# EAGLE schematic DRONEV1 (EAGLE 9.5.1)
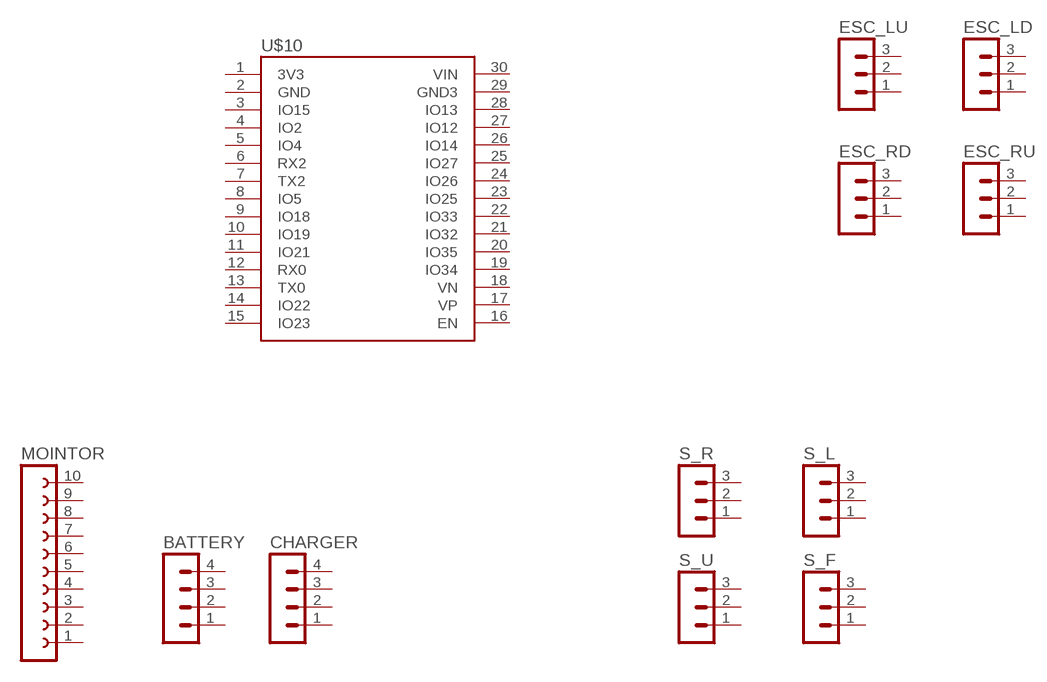
[diagram p0: schematic, sheet 1]

## Parts
BATTERY  MA04-1  [MA04-1]
CHARGER  MA04-1  [MA04-1]
ESC_LD  MA03-1  [MA03-1]
ESC_LU  MA03-1  [MA03-1]
ESC_RD  MA03-1  [MA03-1]
ESC_RU  MA03-1  [MA03-1]
MOINTOR  FE10-1  [FE10]
S_F  MA03-1  [MA03-1]
S_L  MA03-1  [MA03-1]
S_R  MA03-1  [MA03-1]
S_U  MA03-1  [MA03-1]
U$1  MODULE_ESP32_MYV  [MODULE_ESP32-DEVKITC-MYV]  (not placed on a sheet)
U$2  MODULE_ESP32_MYV  [MODULE_ESP32-DEVKITC-MYV]  (not placed on a sheet)
U$3  MODULE_ESP32_MYV  [MODULE_ESP32-DEVKITC-MYV]  (not placed on a sheet)
U$4  MODULE_ESP32_MYV  [MODULE_ESP32-DEVKITC-MYV]  (not placed on a sheet)
U$5  MODULE_ESP32_MYV  [MODULE_ESP32-DEVKITC-MYV]  (not placed on a sheet)
U$6  MODULE_ESP32_MYV  [MODULE_ESP32-DEVKITC-MYV]  (not placed on a sheet)
U$7  MODULE_ESP32_MYV  [MODULE_ESP32-DEVKITC-MYV]  (not placed on a sheet)
U$8  MODULE_ESP32_MYV  [MODULE_ESP32-DEVKITC-MYV]  (not placed on a sheet)
U$9  MODULE_ESP32_MYV  [MODULE_ESP32-DEVKITC-MYV]  (not placed on a sheet)
U$10  MODULE_ESP32_MYV  [MODULE_ESP32-DEVKITC-MYV]
Unconnected: BATTERY.1 BATTERY.2 BATTERY.3 BATTERY.4 CHARGER.1 CHARGER.2 CHARGER.3 CHARGER.4 ESC_LD.1 ESC_LD.2 ESC_LD.3 ESC_LU.1 ESC_LU.2 ESC_LU.3 ESC_RD.1 ESC_RD.2 ESC_RD.3 ESC_RU.1 ESC_RU.2 ESC_RU.3 MOINTOR.1 MOINTOR.2 MOINTOR.3 MOINTOR.4 MOINTOR.5 MOINTOR.6 MOINTOR.7 MOINTOR.8 MOINTOR.9 MOINTOR.10 S_F.1 S_F.2 S_F.3 S_L.1 S_L.2 S_L.3 S_R.1 S_R.2 S_R.3 S_U.1 S_U.2 S_U.3 U$1.2(GND) U$1.3(IO15) U$1.4(IO2) U$1.5(IO4) U$1.6(RX2) U$1.7(TX2) U$1.8(IO5) U$1.9(IO18) U$1.10(IO19) U$1.11(IO21) U$1.12(RX0) U$1.13(TX0) U$1.14(IO22) U$1.15(IO23) U$1.16(EN) U$1.17(VP) U$1.18(VN) U$1.19(IO34) U$1.20(IO35) U$1.21(IO32) U$1.22(IO33) U$1.23(IO25) U$1.24(IO26) U$1.25(IO27) U$1.26(IO14) U$1.27(IO12) U$1.28(IO13) U$2.2(GND) U$2.3(IO15) U$2.4(IO2) U$2.5(IO4) U$2.6(RX2) U$2.7(TX2) U$2.8(IO5) U$2.9(IO18) U$2.10(IO19) U$2.11(IO21) U$2.12(RX0) U$2.13(TX0) U$2.14(IO22) U$2.15(IO23) U$2.16(EN) U$2.17(VP) U$2.18(VN) U$2.19(IO34) U$2.20(IO35) U$2.21(IO32) U$2.22(IO33) U$2.23(IO25) U$2.24(IO26) U$2.25(IO27) U$2.26(IO14) U$2.27(IO12) U$2.28(IO13) U$3.2(GND) U$3.3(IO15) U$3.4(IO2) U$3.5(IO4) U$3.6(RX2) U$3.7(TX2) U$3.8(IO5) U$3.9(IO18) U$3.10(IO19) U$3.11(IO21) U$3.12(RX0) U$3.13(TX0) U$3.14(IO22) U$3.15(IO23) U$3.16(EN) U$3.17(VP) U$3.18(VN) U$3.19(IO34) U$3.20(IO35) U$3.21(IO32) U$3.22(IO33) U$3.23(IO25) U$3.24(IO26) U$3.25(IO27) U$3.26(IO14) U$3.27(IO12) U$3.28(IO13) U$4.2(GND) U$4.3(IO15) U$4.4(IO2) U$4.5(IO4) U$4.6(RX2) U$4.7(TX2) U$4.8(IO5) U$4.9(IO18) U$4.10(IO19) U$4.11(IO21) U$4.12(RX0) U$4.13(TX0) U$4.14(IO22) U$4.15(IO23) U$4.16(EN) U$4.17(VP) U$4.18(VN) U$4.19(IO34) U$4.20(IO35) U$4.21(IO32) U$4.22(IO33) U$4.23(IO25) U$4.24(IO26) U$4.25(IO27) U$4.26(IO14) U$4.27(IO12) U$4.28(IO13) U$5.2(GND) U$5.3(IO15) U$5.4(IO2) U$5.5(IO4) U$5.6(RX2) U$5.7(TX2) U$5.8(IO5) U$5.9(IO18) U$5.10(IO19) U$5.11(IO21) U$5.12(RX0) U$5.13(TX0) U$5.14(IO22) U$5.15(IO23) U$5.16(EN) U$5.17(VP) U$5.18(VN) U$5.19(IO34) U$5.20(IO35) U$5.21(IO32) U$5.22(IO33) U$5.23(IO25) U$5.24(IO26) U$5.25(IO27) U$5.26(IO14) U$5.27(IO12) U$5.28(IO13) U$6.2(GND) U$6.3(IO15) U$6.4(IO2) U$6.5(IO4) U$6.6(RX2) U$6.7(TX2) U$6.8(IO5) U$6.9(IO18) U$6.10(IO19) U$6.11(IO21) U$6.12(RX0) U$6.13(TX0) U$6.14(IO22) U$6.15(IO23) U$6.16(EN) U$6.17(VP) U$6.18(VN) U$6.19(IO34) U$6.20(IO35) U$6.21(IO32) U$6.22(IO33) U$6.23(IO25) U$6.24(IO26) U$6.25(IO27) U$6.26(IO14) U$6.27(IO12) U$6.28(IO13) U$7.2(GND) U$7.3(IO15) U$7.4(IO2) U$7.5(IO4) U$7.6(RX2) U$7.7(TX2) U$7.8(IO5) U$7.9(IO18) U$7.10(IO19) U$7.11(IO21) U$7.12(RX0) U$7.13(TX0) U$7.14(IO22) U$7.15(IO23) U$7.16(EN) U$7.17(VP) U$7.18(VN) U$7.19(IO34) U$7.20(IO35) U$7.21(IO32) U$7.22(IO33) U$7.23(IO25) U$7.24(IO26) U$7.25(IO27) U$7.26(IO14) U$7.27(IO12) U$7.28(IO13) U$8.2(GND) U$8.3(IO15) U$8.4(IO2) U$8.5(IO4) U$8.6(RX2) U$8.7(TX2) U$8.8(IO5) U$8.9(IO18) U$8.10(IO19) U$8.11(IO21) U$8.12(RX0) U$8.13(TX0) U$8.14(IO22) U$8.15(IO23) U$8.16(EN) U$8.17(VP) U$8.18(VN) U$8.19(IO34) U$8.20(IO35) U$8.21(IO32) U$8.22(IO33) U$8.23(IO25) U$8.24(IO26) U$8.25(IO27) U$8.26(IO14) U$8.27(IO12) U$8.28(IO13) U$9.2(GND) U$9.3(IO15) U$9.4(IO2) U$9.5(IO4) U$9.6(RX2) U$9.7(TX2) U$9.8(IO5) U$9.9(IO18) U$9.10(IO19) U$9.11(IO21) U$9.12(RX0) U$9.13(TX0) U$9.14(IO22) U$9.15(IO23) U$9.16(EN) U$9.17(VP) U$9.18(VN) U$9.19(IO34) U$9.20(IO35) U$9.21(IO32) U$9.22(IO33) U$9.23(IO25) U$9.24(IO26) U$9.25(IO27) U$9.26(IO14) U$9.27(IO12) U$9.28(IO13) U$10.2(GND) U$10.3(IO15) U$10.4(IO2) U$10.5(IO4) U$10.6(RX2) U$10.7(TX2) U$10.8(IO5) U$10.9(IO18) U$10.10(IO19) U$10.11(IO21) U$10.12(RX0) U$10.13(TX0) U$10.14(IO22) U$10.15(IO23) U$10.16(EN) U$10.17(VP) U$10.18(VN) U$10.19(IO34) U$10.20(IO35) U$10.21(IO32) U$10.22(IO33) U$10.23(IO25) U$10.24(IO26) U$10.25(IO27) U$10.26(IO14) U$10.27(IO12) U$10.28(IO13)

## Power pins joined to a net without a drawn wire
3V3: U$1.1(3V3) U$2.1(3V3) U$3.1(3V3) U$4.1(3V3) U$5.1(3V3) U$6.1(3V3) U$7.1(3V3) U$8.1(3V3) U$9.1(3V3) U$10.1(3V3)
GND3: U$1.29(GND3) U$2.29(GND3) U$3.29(GND3) U$4.29(GND3) U$5.29(GND3) U$6.29(GND3) U$7.29(GND3) U$8.29(GND3) U$9.29(GND3) U$10.29(GND3)
VIN: U$1.30(VIN) U$2.30(VIN) U$3.30(VIN) U$4.30(VIN) U$5.30(VIN) U$6.30(VIN) U$7.30(VIN) U$8.30(VIN) U$9.30(VIN) U$10.30(VIN)

## Library data of the parts
BATTERY CHARGER = con-lstb:MA04-1: PIN HEADER; OC_FARNELL: unknown; OC_NEWARK: unknown
ESC_LD ESC_LU ESC_RD ESC_RU S_F S_L S_R S_U = con-lstb:MA03-1: PIN HEADER; OC_FARNELL: unknown; OC_NEWARK: unknown
MOINTOR = con-lsta:FE10-1: FEMALE HEADER; OC_FARNELL: unknown; OC_NEWARK: unknown
U$1-U$10 = ESP32-DEVKITC-32D:MODULE_ESP32_MYV